# EAGLE design phMeter v4.2 (EAGLE 6.5.0)
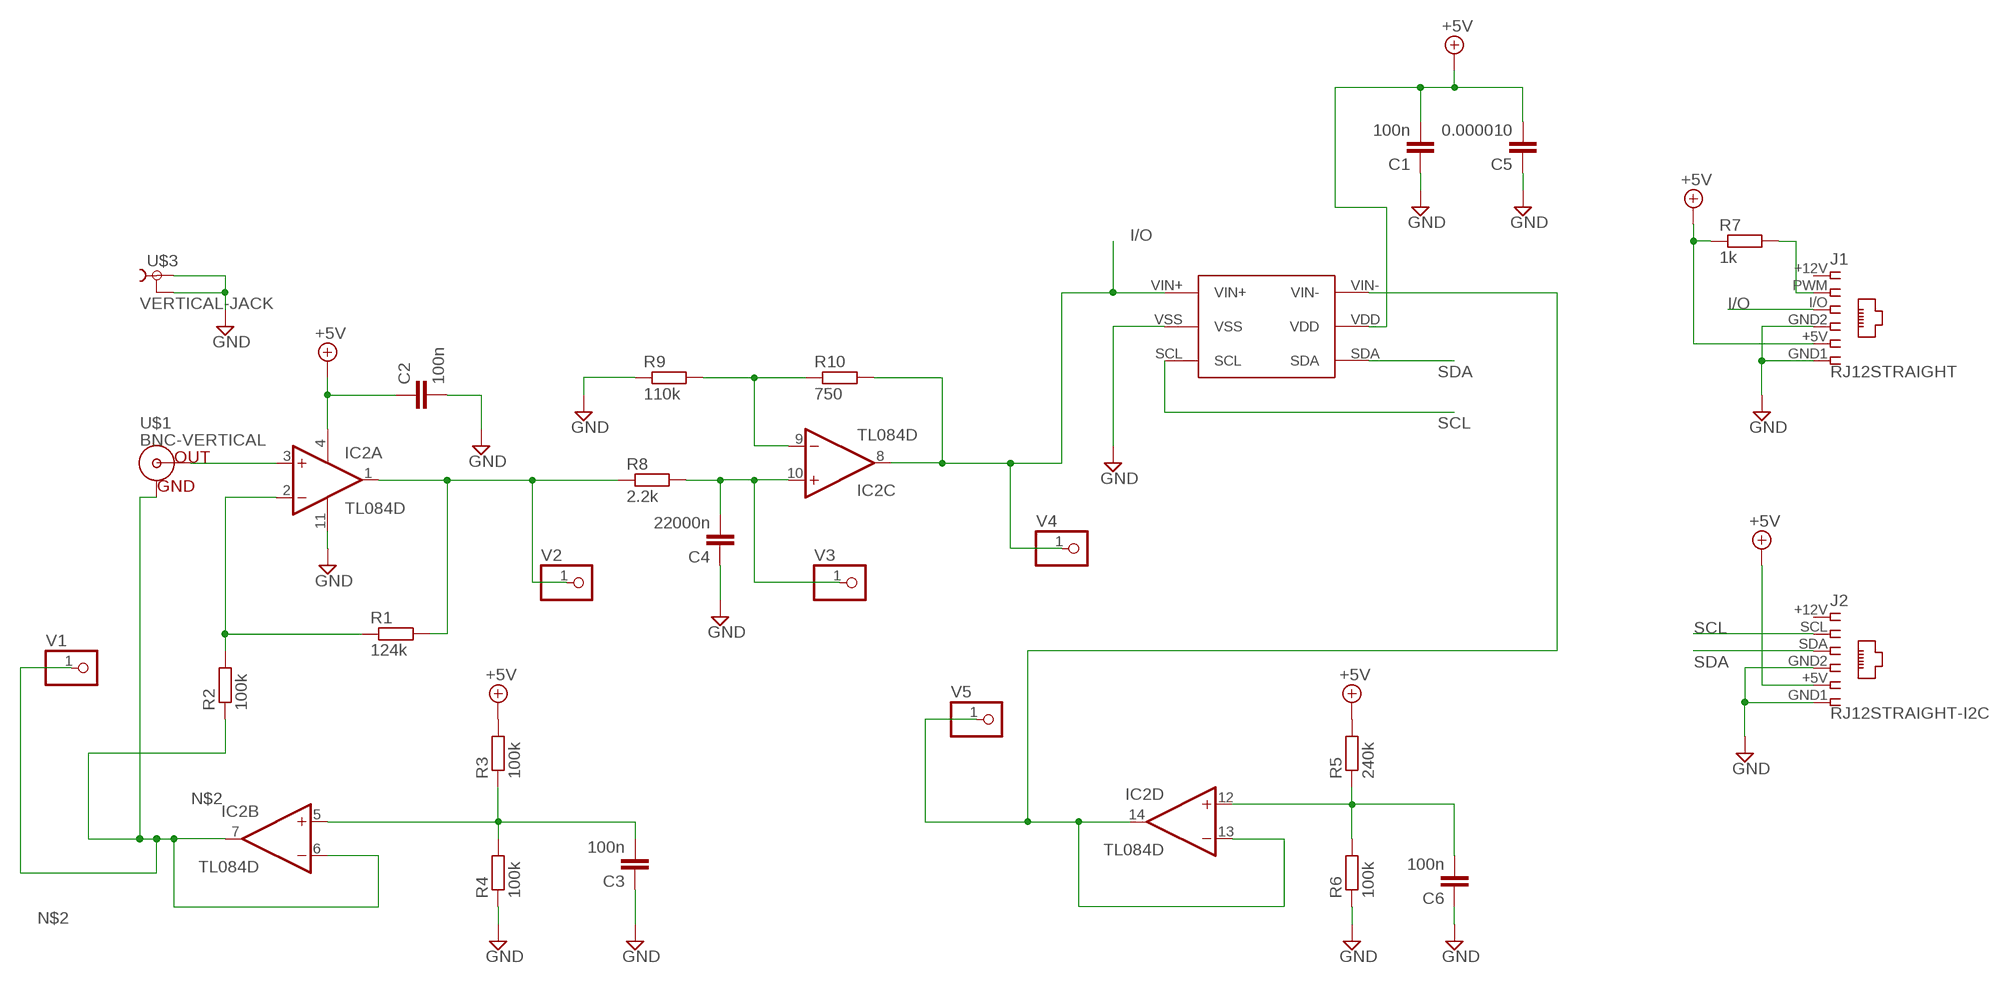
[diagram p0: schematic, sheet 1]

## Parts
C1  100n  C-EUC1206  [C1206]
C2  100n  C-EUC1206  [C1206]
C3  100n  C-EUC1206  [C1206]
C4  22000n  C-EUC1206  [C1206]
C5  0.000010  C-EUC1206  [C1206]
C6  100n  C-EUC1206  [C1206]
IC2  TL084D  [SO14]
J1  RJ12STRAIGHT  [RJ12-STRAIGHT]
J2  RJ12STRAIGHT-I2C  [RJ12-STRAIGHT-I2C]
R1  124k  R-EU_R1206  [R1206]
R2  100k  R-EU_R1206  [R1206]
R3  100k  R-EU_R1206  [R1206]
R4  100k  R-EU_R1206  [R1206]
R5  240k  R-EU_R1206  [R1206]
R6  100k  R-EU_R1206  [R1206]
R7  1k  R-EU_R1206  [R1206]
R8  2.2k  R-EU_R1206  [R1206]
R9  110k  R-EU_R1206  [R1206]
R10  750  R-EU_R1206  [R1206]
U$1  BNC-VERTICAL  [BNC-VERTICAL]
U$3  VERTICAL-JACK  [VERTICAL-JACK]
U$5  MCP3425  [SOT-23-6]
V1  PINHD-1X1  [1X01]
V2  PINHD-1X1  [1X01]
V3  PINHD-1X1  [1X01]
V4  PINHD-1X1  [1X01]
V5  PINHD-1X1  [1X01]

## Nets
+5V: C1.2 C2.1 C5.2 IC2.4(P:V+) J1.+5V J2.+5V R3.2 R5.2 R7.1 U$5.VDD
GND: C1.1 C2.2 C3.1 C4.1 C5.1 C6.1 IC2.11(P:V-) J1.GND1 J1.GND2 J2.GND1 J2.GND2 R4.1 R6.1 R9.1 U$3.P$1 U$3.P$2 U$5.VSS
I/O: IC2.8(C:OUT) J1.I/O R10.2 U$5.VIN+ V4.1
N$1: IC2.2(A:-IN) R1.1 R2.2
N$2: IC2.6(B:-IN) IC2.7(B:OUT) R2.1 U$1.G(GND) V1.1
N$3: J1.PWM R7.2
N$4: IC2.13(D:-IN) IC2.14(D:OUT) U$5.VIN- V5.1
N$5: IC2.3(A:+IN) U$1.S(OUT)
N$7: IC2.1(A:OUT) R1.2 R8.1 V2.1
N$9: C3.2 IC2.5(B:+IN) R3.1 R4.2
N$10: C4.2 IC2.10(C:+IN) R8.2 V3.1
N$11: IC2.9(C:-IN) R9.2 R10.1
N$14: C6.2 IC2.12(D:+IN) R5.1 R6.2
SCL: J2.SCL U$5.SCL
SDA: J2.SDA U$5.SDA
Unconnected: J1.+12V J2.+12V

## Library data of the parts
C1-C6 = rcl:C-EU: CAPACITOR, European symbol
IC2 = linear:TL084: OP AMP
J1 J2 = lpatiny:RJ12: CORCOM Modular RJ Jacks No Shield Source: www.tycoelectronics.com .. ENG_DS_1654001_1099_RJ_L_0507.pdf
R1-R10 = resistor:R-EU_: RESISTOR, European symbol
U$1 = phMeter:BNC-VERTICAL
U$3 = phMeter:VERTICAL-JACK
U$5 = phMeter:MCP3425
V1-V5 = pinhead:PINHD-1X1: PIN HEADER

## Net classes
0 default: width 0.457 mm

## Board
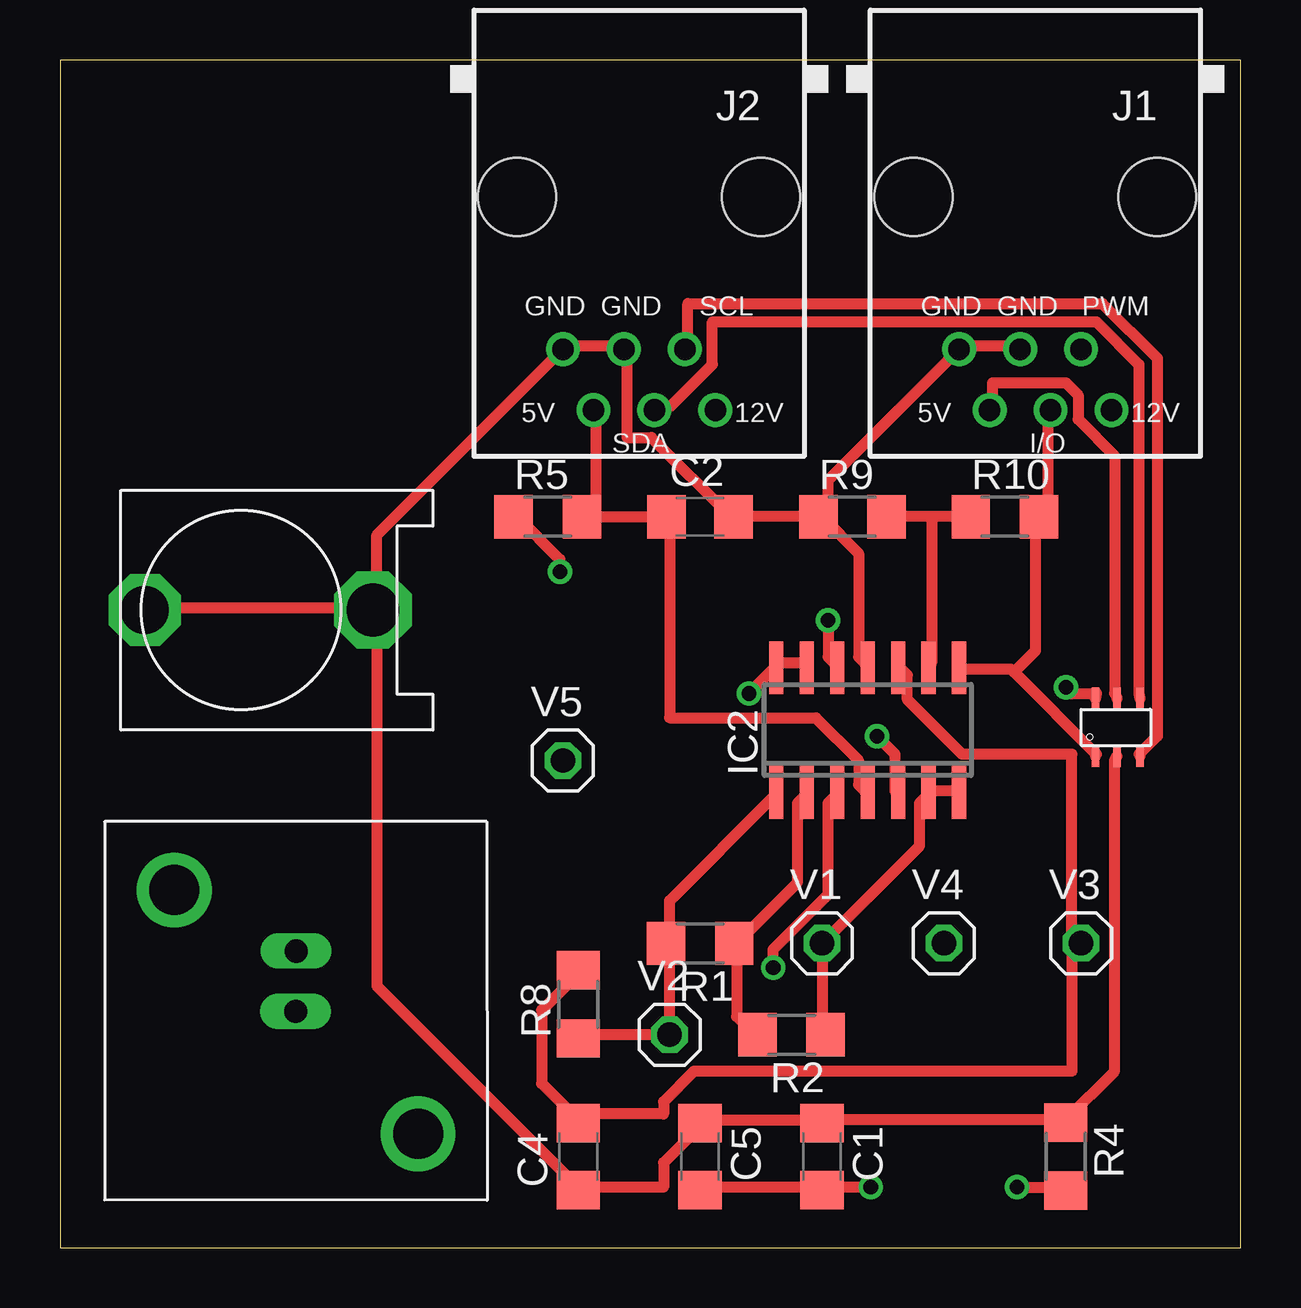
[diagram p1: board, top side]
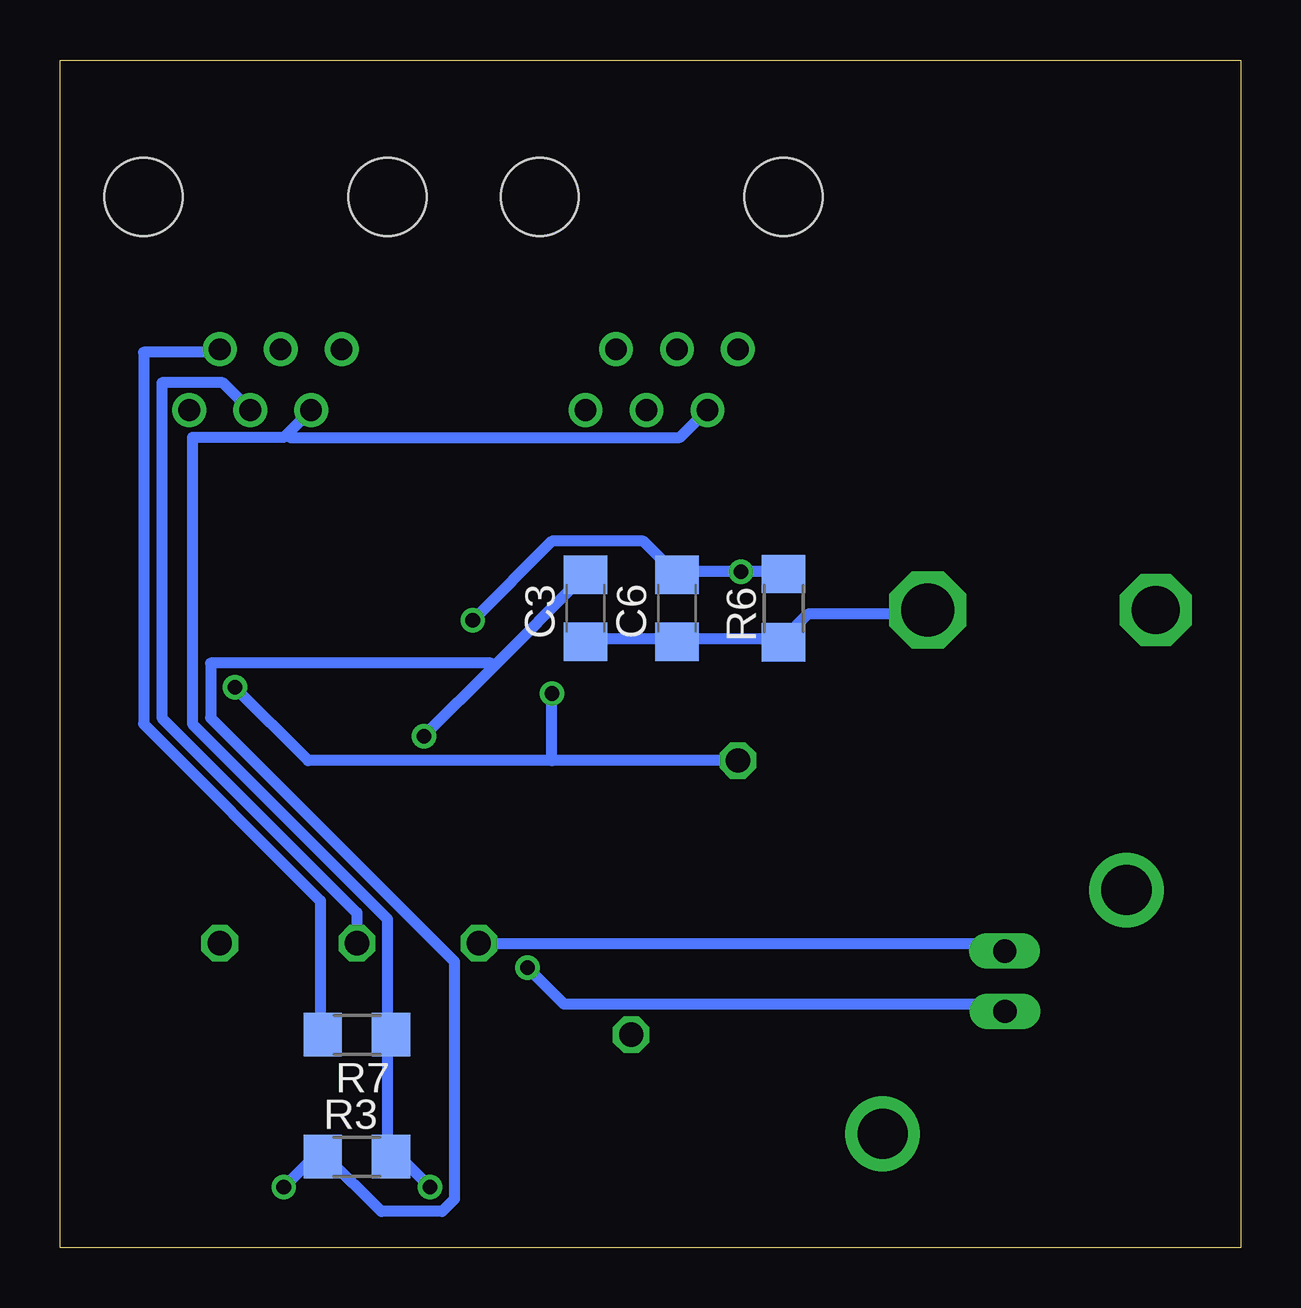
[diagram p2: board, bottom side, seen from below]

Size 49.2 x 49.52 mm. Coordinates in mm from the lower left corner, seen from the top.
Outline: 0,0 49.2,0 49.2,49.52 0,49.52 0,0
Copper layers (1*16): Top 0.035mm / dielectric 1.5mm / Bottom 0.035mm
Design rules "default": minimum track width 10mil, minimum drill 24mil, track to track 8mil, track to pad 8mil, pad to pad 8mil, via to via 8mil, smd to smd 8mil, copper to edge 40mil, drill to drill 8mil, minimum pad ring 10mil, minimum via ring 8mil, stop-mask expansion 4mil, vias tented up to drill 0mil, thermal gap 10mil

### Footprints (pad centres in the part's own frame; a part is rotated, then mirrored left to right if it is on the bottom)
C1206 = smd 1.6 x 1.8: 1 -1.4,0; 2 1.4,0
SO14 = smd 0.6 x 2.2: 1 -3.81,-2.6; 2 -2.54,-2.6; 3 -1.27,-2.6; 4 0,-2.6; 5 1.27,-2.6; 6 2.54,-2.6; 7 3.81,-2.6; 8 3.81,2.6; 9 2.54,2.6; 10 1.27,2.6; 11 0,2.6; 12 -1.27,2.6; 13 -2.54,2.6; 14 -3.81,2.6
RJ12-STRAIGHT = drill 0.9 pad 1.4: +5V 1.905,8.89; +12V -3.175,8.89; GND1 3.175,6.35; GND2 0.635,6.35; I/O -0.635,8.89; PWM -1.905,6.35 | hole 3.251: -5.08,0; 5.08,0
RJ12-STRAIGHT-I2C = drill 0.9 pad 1.4: +5V 1.905,8.89; +12V -3.175,8.89; GND1 3.175,6.35; GND2 0.635,6.35; SCL -1.905,6.35; SDA -0.635,8.89 | hole 3.251: -5.08,0; 5.08,0
R1206 = smd 1.6 x 1.803: 1 -1.422,0; 2 1.422,0
BNC-VERTICAL = drill 0.97 long: G 5.4,-7.94; S 7.92,-7.96 | drill 2.09: P$3 13.02,-2.86; P$4 2.86,-13.02
VERTICAL-JACK = drill 2 octagon: P$1 5,-1 | drill 2.2 octagon: P$2 5,-10.5
SOT-23-6 = smd 0.305 x 0.9: SCL 2.45,-0.45; SDA 2.45,1.95; VDD 1.5,1.95; VIN+ 0.6,-0.45; VIN- 0.6,1.95; VSS 1.5,-0.45
1X01 = drill 1.016 octagon: 1 0,0

### Placement (x,y rotation side)
C1  31.75,3.81 270 top
C2  26.67,30.48 0 top
C3  27.3,26.67 90 bottom
C4  21.59,3.81 90 top
C5  26.67,3.81 270 top
C6  23.5,26.67 90 bottom
IC2  33.66,21.59 0 top
J1  40.64,43.81 180 top
J2  24.13,43.81 180 top
R1  26.67,12.7 180 top
R2  30.48,8.89 180 top
R3  36.83,3.81 0 bottom
R4  41.91,3.81 270 top
R5  20.32,30.48 0 top
R6  19.05,26.67 90 bottom
R7  36.83,8.89 180 bottom
R8  21.59,10.16 90 top
R9  33.02,30.48 0 top
R10  39.37,30.48 0 top
U$1  17.78,17.78 270 top
U$3  2.54,21.59 90 top
U$5  42.55,20.95 0 top
V1  31.75,12.7 0 top
V2  25.4,8.89 0 top
V3  42.55,12.7 0 top
V4  36.83,12.7 0 top
V5  20.95,20.32 0 top

### Tracks (layer width: path | path; a pad name or v marks a point on that pad's centre or on a via)
+5V  (via drill 0.61)
  Top 0.457: 22.35,30.48 21.84,30.48 R5.2 22.35,30.48 | 22.35,30.48 25.15,30.48 C2.1 25.4,30.48 25.4,22.1 31.5,22.1 33.27,20.32 33.27,19.3 33.53,19.05 IC2.4 | 22.35,30.48 22.35,34.8 J2.+5V | 31.75,2.54 26.67,2.54 C5.2 | 31.75,2.54 C1.2 31.75,2.54 | v33.78,2.54 31.75,2.54 | U$5.VDD 43.94,23.11 43.94,33.02 42.42,34.54 42.42,35.56 41.91,36.07 38.86,36.07 38.86,35.05 J1.+5V
  Bottom 0.457: 35.56,8.89 35.56,3.81 R3.2 35.31,3.81 35.05,3.81 v33.78,2.54 | 35.56,8.89 R7.1 35.56,8.89 | 35.56,8.89 35.56,13.72 43.69,21.84 43.69,33.78 39.88,33.78 39.75,33.91 | 39.75,33.91 38.86,34.8 J1.+5V | J2.+5V 22.35,34.8 23.37,33.78 39.62,33.78 39.75,33.91
GND
  Top 0.457: 21.59,2.54 25.15,2.54 25.15,3.56 26.67,5.08 C5.1 26.67,5.33 31.75,5.33 | 21.59,2.54 C4.1 21.59,2.54 | 31.75,5.33 C1.1 31.75,5.33 | 41.91,5.33 43.94,7.37 43.94,20.32 U$5.VSS | 41.91,5.33 R4.1 41.91,5.33 | 41.91,5.33 31.75,5.33 | J1.GND2 39.88,37.59 37.59,37.59 J1.GND1 37.34,37.34 32,32 32,30.48 R9.1 | R9.1 31.5,30.48 28.19,30.48 C2.2 27.94,30.48 24.64,33.78 23.62,33.78 23.62,37.34 J2.GND2 23.37,37.59 21.08,37.59 J2.GND1 20.83,37.34 13.21,29.72 13.21,26.67 U$3.P$2 | IC2.11 33.53,24.38 33.27,24.64 33.27,28.96 31.75,30.48 R9.1 | U$3.P$1 3.56,26.67 12.95,26.67 U$3.P$2 | 21.59,2.54 13.21,10.92 13.21,26.42 U$3.P$2
  Bottom 0.457: C3.1 27.18,25.4 23.62,25.4 C6.1 23.37,25.4 19.05,25.4 | 19.05,25.4 R6.1 19.05,25.4 | 19.05,25.4 18.03,26.42 13.21,26.42 U$3.P$2
I/O
  Top 0.457: 39.75,24 39.62,24.13 37.59,24.13 IC2.8 | 39.75,24 43.18,20.57 U$5.VIN+ | J1.I/O 41.15,34.8 41.15,30.73 40.89,30.48 R10.2 40.64,30.48 40.64,24.89 39.88,24.13 39.75,24
  Bottom 0.457: V4.1 36.83,13.97 44.96,22.1 44.96,36.07 42.42,36.07 41.4,35.05 J1.I/O
N$1
  Top 0.457: 28.19,12.7 28.19,9.65 28.96,8.89 R2.2 | 28.19,12.7 R1.1 28.19,12.7 | 28.19,12.7 30.73,15.24 30.73,18.54 30.99,18.8 IC2.2
N$2
  Top 0.457: IC2.7 37.34,19.05 36.32,19.05 IC2.6 36.07,18.8 35.81,18.54 35.81,16.76 V1.1 31.75,8.89 R2.1
  Bottom 0.457: V1.1 10.16,12.7 9.91,12.45 U$1.G
N$3
  Bottom 0.457: R7.2 38.35,8.89 38.35,14.48 45.72,21.84 45.72,37.34 42.67,37.34 J1.PWM
N$4  (via drill 0.61)
  Top 0.457: IC2.13 30.99,24.38 29.97,24.38 IC2.14 29.72,24.13 v28.7,23.11 | v41.91,23.37 41.91,23.11 43.18,23.11 U$5.VIN-
  Bottom 0.457: v41.91,23.37 38.86,20.32 28.7,20.32 | 28.7,20.32 21.08,20.32 V5.1 | 28.7,20.32 v28.7,23.11
N$5  (via drill 0.61)
  Top 0.457: v29.72,11.68 29.72,12.45 32,14.73 32,18.54 32.26,18.8 IC2.3
  Bottom 0.457: v29.72,11.68 28.19,10.16 10.16,10.16 9.91,9.91 U$1.S
N$7
  Top 0.457: R8.1 21.59,8.89 V2.1 25.4,12.7 | 25.4,12.7 R1.2 25.4,12.7 | 25.4,12.7 25.4,14.48 29.72,18.8 IC2.1
N$9  (via drill 0.61)
  Top 0.457: v39.88,2.54 41.91,2.54 R4.2 | v34.04,21.34 34.8,20.57 34.8,19.05 IC2.5
  Bottom 0.457: v39.88,2.54 38.61,3.81 38.35,3.81 R3.1 38.1,3.81 35.81,1.52 33.27,1.52 32.77,2.03 32.77,11.94 42.93,22.1 42.93,24.38 31.24,24.38 31.11,24.26 | v34.04,21.34 31.11,24.26 | 31.11,24.26 27.43,27.94 C3.2
N$10
  Top 0.457: R8.2 21.59,11.43 20.07,9.91 20.07,6.86 21.59,5.33 C4.2 21.59,5.59 25.15,5.59 25.15,6.1 26.42,7.37 42.16,7.37 42.16,12.7 V3.1 42.42,12.7 42.16,12.95 42.16,20.57 37.59,20.57 35.31,22.86 35.31,23.88 35.05,24.13 IC2.10
N$11
  Top 0.457: 36.32,30.48 37.85,30.48 R10.1 | 36.32,30.48 34.54,30.48 R9.2 | 36.32,30.48 36.32,24.38 IC2.9
N$14  (via drill 0.61)
  Top 0.457: v20.83,28.19 20.83,28.7 19.05,30.48 R5.1 | v32,26.16 32,24.64 32.26,24.38 IC2.12
  Bottom 0.457: R6.2 19.05,28.19 v20.83,28.19 23.37,28.19 C6.2 23.62,28.19 24.89,29.46 28.7,29.46 v32,26.16
SCL
  Top 0.457: U$5.SCL 44.96,20.57 45.72,21.34 45.72,37.08 43.43,39.37 26.16,39.37 26.16,37.59 J2.SCL
SDA
  Top 0.457: U$5.SDA 44.96,23.11 44.96,36.83 43.18,38.61 27.18,38.61 27.18,36.83 25.4,35.05 24.89,35.05 J2.SDA